# EAGLE schematic hand (EAGLE 9.6.1)
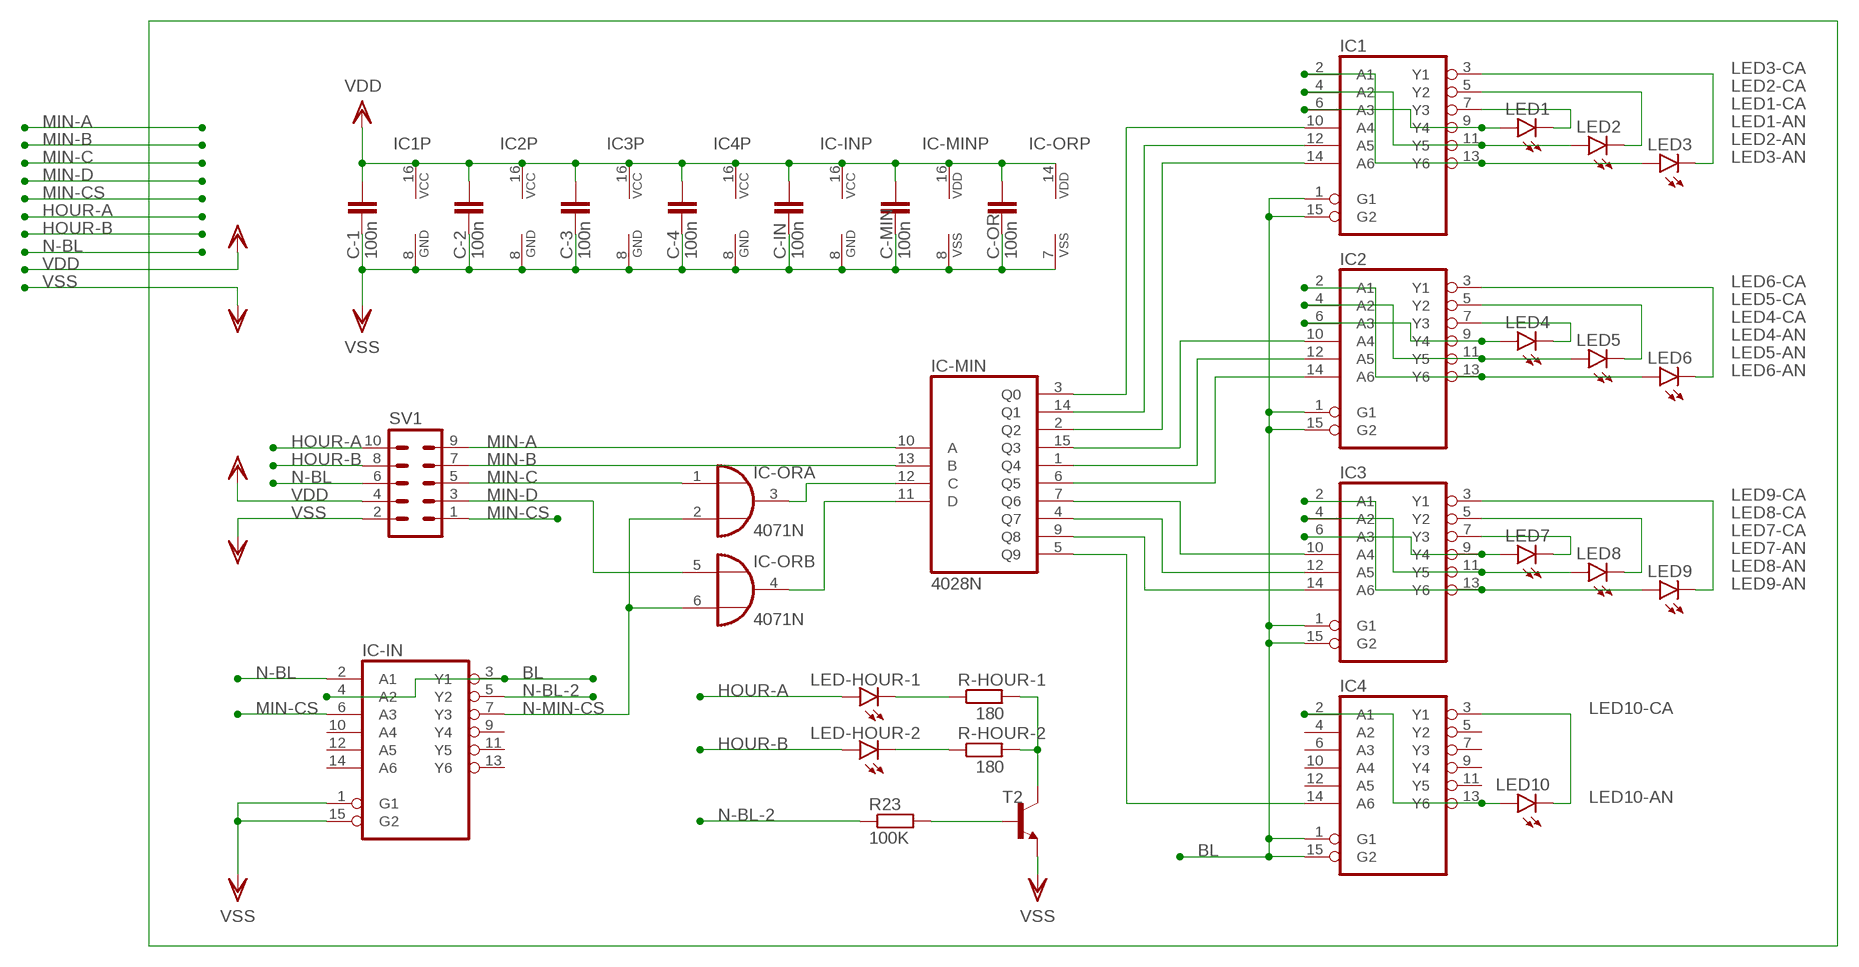
[diagram p0: schematic, sheet 1]

## Parts
C-1  100n  C-EU050-025X075  [C050-025X075]
C-2  100n  C-EU050-025X075  [C050-025X075]
C-3  100n  C-EU050-025X075  [C050-025X075]
C-4  100n  C-EU050-025X075  [C050-025X075]
C-IN  100n  C-EU050-025X075  [C050-025X075]
C-MIN  100n  C-EU050-025X075  [C050-025X075]
C-OR  100n  C-EU050-025X075  [C050-025X075]
IC1  74HC366N  [DIL16]
IC2  74HC366N  [DIL16]
IC3  74HC366N  [DIL16]
IC4  74HC366N  [DIL16]
IC-IN  74HC366N  [DIL16]
IC-MIN  4028N  [DIL16]
IC-OR  4071N  [DIL14]
LED1  LED5MM  [LED5MM]
LED2  LED5MM  [LED5MM]
LED3  LED5MM  [LED5MM]
LED4  LED5MM  [LED5MM]
LED5  LED5MM  [LED5MM]
LED6  LED5MM  [LED5MM]
LED7  LED5MM  [LED5MM]
LED8  LED5MM  [LED5MM]
LED9  LED5MM  [LED5MM]
LED10  LED5MM  [LED5MM]
LED-HOUR-1  LED10MM  [LED10MM]
LED-HOUR-2  LED10MM  [LED10MM]
R23  100K  R-EU_0207/10  [0207/10]
R-HOUR-1  180  R-EU_0207/10  [0207/10]
R-HOUR-2  180  R-EU_0207/10  [0207/10]
SV1  ML10  [ML10]
T2  BC547-NPN-TO92-CBE  [TO92-CBE]

## Nets
BL: IC1.1(G1) IC1.15(G2) IC2.1(G1) IC2.15(G2) IC3.1(G1) IC3.15(G2) IC4.1(G1) IC4.15(G2) IC-IN.3(Y1) IC-IN.4(A2)
HOUR-A: LED-HOUR-1.A SV1.10
HOUR-B: LED-HOUR-2.A SV1.8
LED1-AN: IC1.6(A3) IC1.9(Y4) LED1.A
LED1-CA: IC1.7(Y3) LED1.K(C)
LED2-AN: IC1.4(A2) IC1.11(Y5) LED2.A
LED2-CA: IC1.5(Y2) LED2.K(C)
LED3-AN: IC1.2(A1) IC1.13(Y6) LED3.A
LED3-CA: IC1.3(Y1) LED3.K(C)
LED4-AN: IC2.6(A3) IC2.9(Y4) LED4.A
LED4-CA: IC2.7(Y3) LED4.K(C)
LED5-AN: IC2.4(A2) IC2.11(Y5) LED5.A
LED5-CA: IC2.5(Y2) LED5.K(C)
LED6-AN: IC2.2(A1) IC2.13(Y6) LED6.A
LED6-CA: IC2.3(Y1) LED6.K(C)
LED7-AN: IC3.6(A3) IC3.9(Y4) LED7.A
LED7-CA: IC3.7(Y3) LED7.K(C)
LED8-AN: IC3.4(A2) IC3.11(Y5) LED8.A
LED8-CA: IC3.5(Y2) LED8.K(C)
LED9-AN: IC3.2(A1) IC3.13(Y6) LED9.A
LED9-CA: IC3.3(Y1) LED9.K(C)
LED10-AN: IC4.2(A1) IC4.13(Y6) LED10.A
LED10-CA: IC4.3(Y1) LED10.K(C)
MIN-A: IC-MIN.10(A) SV1.9
MIN-B: IC-MIN.13(B) SV1.7
MIN-C: IC-OR.1(A:I0) SV1.5
MIN-CS: IC-IN.6(A3) SV1.1
MIN-D: IC-OR.5(B:I0) SV1.3
N$4: IC3.10(A4) IC-MIN.7(Q6)
N$8: IC1.10(A4) IC-MIN.3(Q0)
N$16: IC2.14(A6) IC-MIN.6(Q5)
N$62: IC1.12(A5) IC-MIN.14(Q1)
N$63: IC1.14(A6) IC-MIN.2(Q2)
N$64: IC2.10(A4) IC-MIN.15(Q3)
N$65: IC2.12(A5) IC-MIN.1(Q4)
N$67: IC3.12(A5) IC-MIN.4(Q7)
N$68: IC3.14(A6) IC-MIN.9(Q8)
N$69: IC4.14(A6) IC-MIN.5(Q9)
N$80: IC-MIN.12(C) IC-OR.3(A:O)
N$81: IC-MIN.11(D) IC-OR.4(B:O)
N$86: R-HOUR-1.2 R-HOUR-2.2 T2.C
N$87: LED-HOUR-1.K(C) R-HOUR-1.1
N$88: LED-HOUR-2.K(C) R-HOUR-2.1
N$91: R23.2 T2.B
N-BL: IC-IN.2(A1) SV1.6
N-BL-2: IC-IN.5(Y2) R23.1
N-MIN-CS: IC-IN.7(Y3) IC-OR.2(A:I1) IC-OR.6(B:I1)
VDD: C-1.1 C-2.1 C-3.1 C-4.1 C-IN.1 C-MIN.1 C-OR.1 IC1.16(VCC) IC2.16(VCC) IC3.16(VCC) IC4.16(VCC) IC-IN.16(VCC) IC-MIN.16(VDD) IC-OR.14(P:VDD) SV1.4
VSS: C-1.2 C-2.2 C-3.2 C-4.2 C-IN.2 C-MIN.2 C-OR.2 IC1.8(GND) IC2.8(GND) IC3.8(GND) IC4.8(GND) IC-IN.1(G1) IC-IN.8(GND) IC-IN.15(G2) IC-MIN.8(VSS) IC-OR.7(P:VSS) SV1.2 T2.E
Unconnected: IC4.4(A2) IC4.5(Y2) IC4.6(A3) IC4.7(Y3) IC4.9(Y4) IC4.10(A4) IC4.11(Y5) IC4.12(A5) IC-IN.9(Y4) IC-IN.10(A4) IC-IN.11(Y5) IC-IN.12(A5) IC-IN.13(Y6) IC-IN.14(A6) IC-OR.8(C:I0) IC-OR.9(C:I1) IC-OR.10(C:O) IC-OR.11(D:O) IC-OR.12(D:I0) IC-OR.13(D:I1)

## Library data of the parts
C-1-C-4 C-IN C-MIN C-OR = rcl:C-EU: CAPACITOR, European symbol; SPICEPREFIX: C
IC1-IC4 IC-IN = 74xx-eu:74*366: Hex BUS DRIVER, 3-state
IC-MIN = 40xx:4028: BCD to decimal DECODER
IC-OR = 40xx:4071: Quad 2-input OR
LED1-LED10 LED-HOUR-1 LED-HOUR-2 = led:LED: LED OSRAM: - CHIPLED LG R971, LG N971, LY N971, LG Q971, LY Q971, LO R971, LY R971 LH N974, LH R974 LS Q976, LO Q976, LY Q976 LO Q996 - Hyper CHIPLED LW Q18S LB Q993, LB Q99A, LB R99A - SideLED LS A670, LO A670, LY A670, LG A670, LP A670 LB A673, LV A673, LT A673, LW A673 LH A674 LY A675 LS A676, LA A676, LO A676, LY A676, LW A676 LS A679, LY A679, LG A679 - Hyper Micro SIDELED® LS Y876, LA Y876, LO Y876, LY Y876 LT Y87S - SmartLED LW L88C, LW L88S LB L89C, LB L89S, LG L890 LS L89K, LO L89K, LY L89K LS L896, LA L896, LO L896, LY L896 - TOPLED LS T670, LO T670, LY T670, LG T670, LP T670 LSG T670, LSP T670, LSY T670, LOP T670, LYG T670 LG T671, LOG T671, LSG T671 LB T673, LV T673, LT T673, LW T673 LH T674 LS T676, LA T676, LO T676, LY T676, LB T676, LH T676, LSB T676, LW T676 LB T67C, LV T67C, LT T67C, LS T67K, LO T67K, LY T67K, LW E67C LS E67B, LA E67B, LO E67B, LY E67B, LB E67C, LV E67C, LT E67C LW T67C LS T679, LY T679, LG T679 LS T770, LO T770, LY T770, LG T770, LP T770 LB T773, LV T773, LT T773, LW T773 LH T774 LS E675, LA E675, LY E675, LS T675 LS T776, LA T776, LO T776, LY T776, LB T776 LHGB T686 LT T68C, LB T68C - Hyper Mini TOPLED® LB M676 - Mini TOPLED Santana® LG M470 LS M47K, LO M47K, LY M47K Source: http://www.osram.convergy.de LUXEON: - LUMILED® LXK2-PW12-R00, LXK2-PW12-S00, LXK2-PW14-U00, LXK2-PW14-V00 LXK2-PM12-R00, LXK2-PM12-S00, LXK2-PM14-U00 LXK2-PE12-Q00, LXK2-PE12-R00, LXK2-PE12-S00, LXK2-PE14-T00, LXK2-PE14-U00 LXK2-PB12-K00, LXK2-PB12-L00, LXK2-PB12-M00, LXK2-PB14-N00, LXK2-PB14-P00, LXK2-PB14-Q00 LXK2-PR12-L00, LXK2-PR12-M00, LXK2-PR14-Q00, LXK2-PR14-R00 LXK2-PD12-Q00, LXK2-PD12-R00, LXK2-PD12-S00 LXK2-PH12-R00, LXK2-PH12-S00 LXK2-PL12-P00, LXK2-PL12-Q00, LXK2-PL12-R00 Source: www.luxeon.com KINGBRIGHT: KA-3528ASYC Source: www.kingbright.com
R23 R-HOUR-1 R-HOUR-2 = rcl:R-EU_: RESISTOR, European symbol; SPICEPREFIX: R
SV1 = con-harting-ml:ML10: HARTING; OC_FARNELL: unknown; OC_NEWARK: unknown
T2 = transistor:*-NPN-: NPN Transistror BF959 corrected 2008.03.06